# EasyEDA Pro project MINIPC_Board.eprj

# Schematic Schematic1
Create Date: 2023-06-23; Page Name: P1; Project Name: MINIPC_Board; Schematic Name: Schematic1; Update Date: 2023-08-16; Company: 嘉立创EDA; Page Size: A4; Version: V1.1
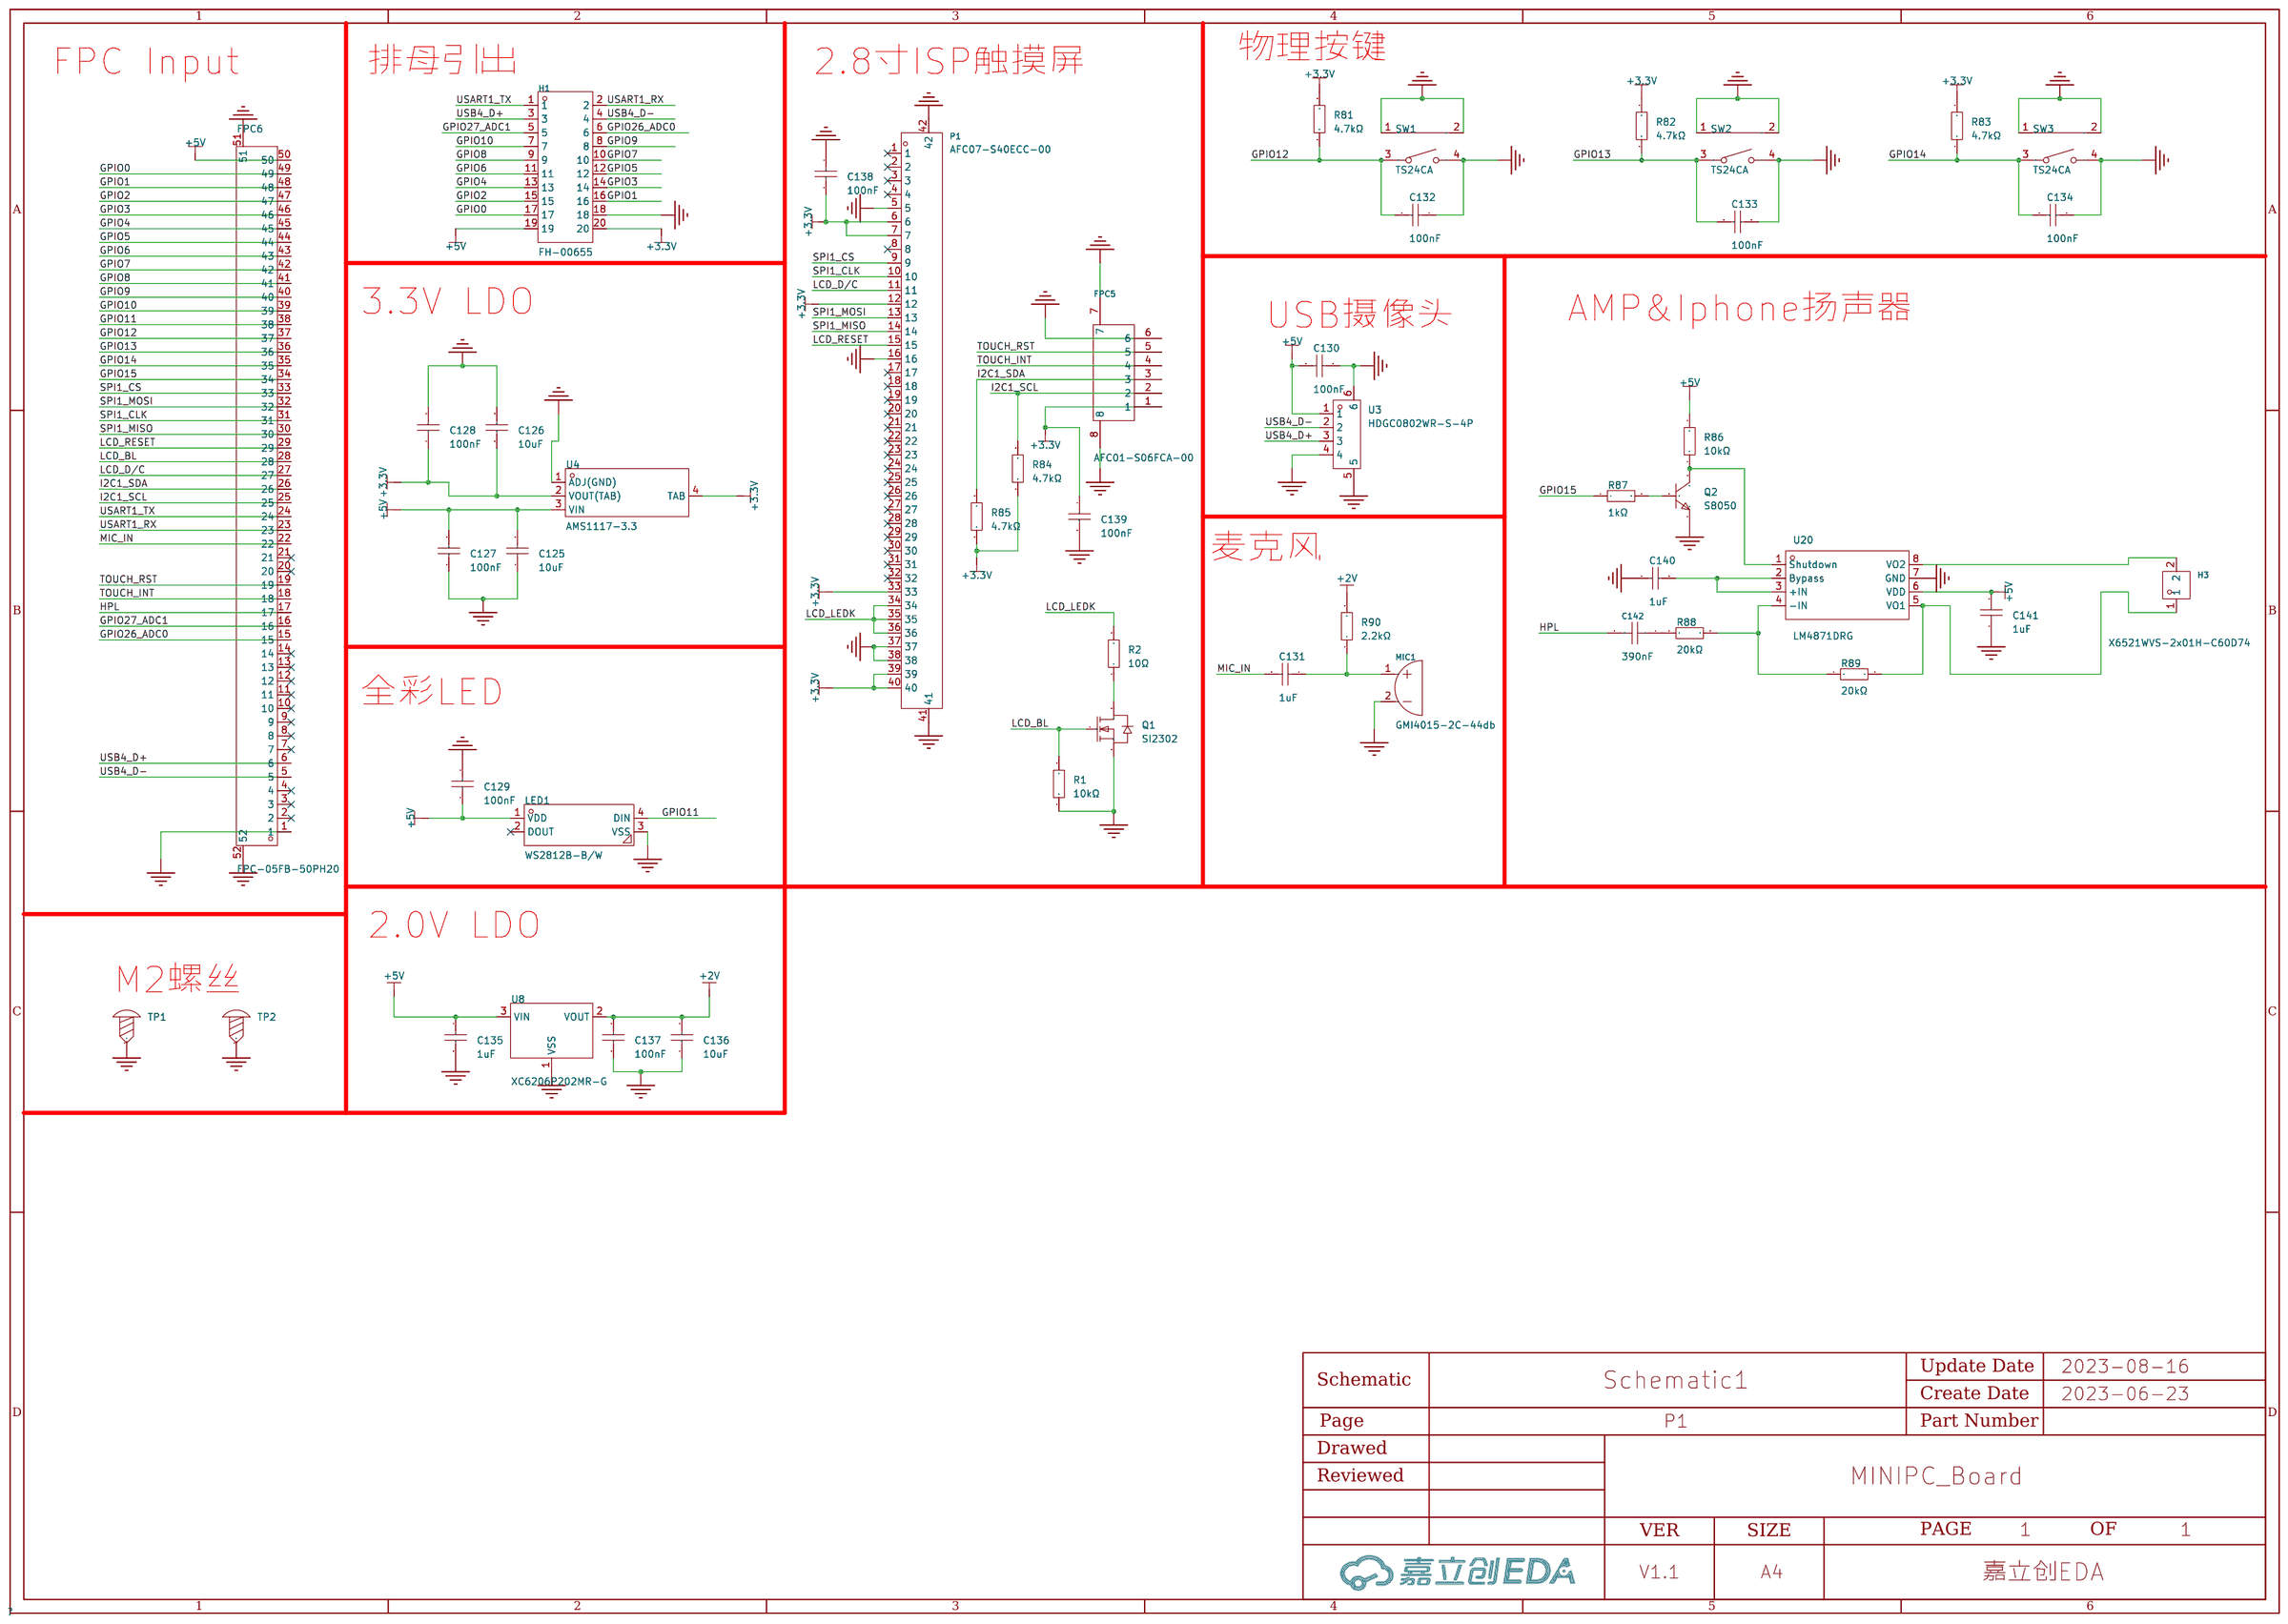
[diagram p0: schematic sheet]

## Parts
C125  10uF  [C0805]
C126  10uF  [C0805]
C127  100nF  [C0805]
C128  100nF  [C0805]
C129  100nF  [C0805]
C130  100nF  [C0805]
C131  1uF  [C0805]
C132  100nF  [C0805]
C133  100nF  [C0805]
C134  100nF  [C0805]
C135  1uF  [C0805]
C136  10uF  [C0805]
C137  100nF  [C0805]
C138  100nF  [C0805]
C139  100nF  [C0805]
C140  1uF  [C0805]
C141  1uF  [C0805]
C142  390nF  [C0805]
FPC5  AFC01-S06FCA-00  [FPC-SMD_P0.50-6P_AFC01-S06FCA-00]
FPC6  FPC-05FB-50PH20  [FPC-SMD_50P-P0.50_FPC-05FB-50PH20]
H1  FH-00655  [HDR-SMD_20P-P2.54-V-F-R2-C10-S2.54-LS7.2-1]
H3  X6521WVS-2x01H-C60D74  [HDR-SMD_2P-P2.54-V-M-R2-C1-LS7.4]
LED1  WS2812B-B/W  [LED-SMD_4P-L5.0-W5.0-BL_TC5050RGB]
MIC1  GMI4015-2C-44db  [MIC-SMD_BD4.0_GMI4015-2C-32DB]
P1  AFC07-S40ECC-00  [CONN-SMD_AFC07-S40ECC-00]
Q1  SI2302  [SOT-23-3_L2.9-W1.5-P1.90-LS2.6-BL]
Q2  S8050  [SOT-23-3_L2.9-W1.6-P1.90-LS2.8-BR]
R1  10kΩ  [R0805]
R2  10Ω  [R0805_NEW]
R81  4.7kΩ  [R0805]
R82  4.7kΩ  [R0805]
R83  4.7kΩ  [R0805]
R84  4.7kΩ  [R0805]
R85  4.7kΩ  [R0805]
R86  10kΩ  [R0805]
R87  1kΩ  [R0805]
R88  20kΩ  [R0805]
R89  20kΩ  [R0805]
R90  2.2kΩ  [R0805]
SW1  TS24CA  [SW-SMD_TS24CA]
SW2  TS24CA  [SW-SMD_TS24CA]
SW3  TS24CA  [SW-SMD_TS24CA]
TP1  -  [M2螺丝]
TP2  -  [M2螺丝]
U3  HDGC0802WR-S-4P  [CONN-SMD_4P-P0.80_HDGC_HDGC0802WR-S-4P]
U4  AMS1117-3.3  [SOT-223-4_L6.5-W3.5-P2.30-LS7.0-BR]
U8  XC6206P202MR-G  [SOT-23-3_L2.9-W1.6-P1.90-LS2.8-BR]
U20  LM4871DRG  [SOP-8_L4.9-W3.9-P1.27-LS6.0-BL]

## Library data of the parts
C125 C126 C136 = CL21A106KAYNNNE_C15850: 容值:10uF;精度:±10%;额定电压:25V;材质(温度系数):X5R;; LCSC Part Name: 10uF ±10% 25V; Supplier Part: C15850; Manufacturer: SAMSUNG(三星); Manufacturer Part: CL21A106KAYNNNE; Supplier Footprint: 0805; JLCPCB Part Class: Basic Part; Datasheet: https://atta.szlcsc.com/upload/public/pdf/source/20160103/1457707679302.pdf; Supplier: LCSC; Tolerance: ±10%; Voltage Rated: 25V; Temperature Coefficient: X5R
C127-C130 C132-C134 C137-C139 = 0805B104K500NT: 容值:100nF;精度:±10%;额定电压:50V;材质(温度系数):X7R;; LCSC Part Name: 100nF ±10% 50V; Supplier Part: C38141; Manufacturer: FH(风华); Supplier Footprint: 0805; JLCPCB Part Class: Extended Part; Datasheet: https://atta.szlcsc.com/upload/public/pdf/source/20170923/C38141_1506149447419988747.pdf; Supplier: LCSC; Tolerance: ±10%; Voltage Rated: 50V; Temperature Coefficient: X7R
C131 C135 C140 C141 = CL21B105KBFNNNE: 容值:1uF;精度:±10%;额定电压:50V;材质(温度系数):X7R;; LCSC Part Name: 1uF ±10% 50V; Supplier Part: C28323; Manufacturer: SAMSUNG(三星); Supplier Footprint: 0805; JLCPCB Part Class: Basic Part; Datasheet: https://atta.szlcsc.com/upload/public/pdf/source/20160103/1457707718219.pdf; Supplier: LCSC; Tolerance: ±10%; Voltage Rated: 50V; Temperature Coefficient: X7R
C142 = 0805B394K500CT: 容值:390nF;精度:±10%;额定电压:50V;材质(温度系数):X7R;; LCSC Part Name: 390nF ±10% 50V; Supplier Part: C384757; Manufacturer: Walsin(华新科); Supplier Footprint: 0805; JLCPCB Part Class: Extended Part; Supplier: LCSC; Tolerance: ±10%; Voltage Rated: 50V; Temperature Coefficient: X7R
FPC5 = AFC01-S06FCA-00: 间距:0.5mm;触点数量:6;锁定特性:翻盖式;安装类型:卧贴;触点类型:下接;; LCSC Part Name: FPC 0.5MM 6P 翻盖式 H2.0mm 下接; Supplier Part: C262655; Manufacturer: JS(钜硕电子); Supplier Footprint: P=0.5mm; JLCPCB Part Class: Extended Part; Supplier: LCSC; Pitch: 0.5mm; Number of Contacts: 6; Locking Feature: 翻盖式; Mounting Type: 卧贴; Contact Type: 下接; Height Above Board: 2mm; FFC, FCB Thickness: 0.3mm~0.3mm
FPC6 = FPC-05FB-50PH20: LCSC Part Name: 50P 0.5mm; Supplier Part: C2856838; Manufacturer: XUNPU(讯普); Supplier Footprint: SMD; JLCPCB Part Class: Extended Part; Datasheet: https://atta.szlcsc.com/upload/public/pdf/source/20210922/C2856838_347828C5274658FED2C30B32DE7AFA84.pdf; Supplier: LCSC
H1 = FH-00655: 排数:双排;总孔位数:20;间距:2.54mm;插孔结构:2x10P;行距:2.54mm;安装类型:立贴;圆孔/方孔:方孔;额定电流:3A;额定电压:-;插孔方向:顶部;塑高:8.5mm;工作温度范围:-40℃~+105℃;; LCSC Part Name: 2.54mm 2x10P; Supplier Part: C2829891; Manufacturer: Liansheng(连盛); Supplier Footprint: SMD,P=2.54mm; JLCPCB Part Class: Extended Part; Datasheet: 2022-08-08/481500A/efd21766f8f54edaba90848846504a55/C2829891.PDF; Supplier: LCSC; Number of Rows: 双排; Number of Holes: 20; Pitch: 2.54mm; Holes Structure: 2x10P; Row Spacing: 2.54mm; Mounting Type: 立贴; Circular Hole / Square Hole: 方孔; Current Rating (Max): 3A; Holes Direction: 顶部; Insulation Height: 8.5mm; Operating Temperature Range: -40℃~+105℃
H3 = X6521WVS-2x01H-C60D74: 间距:2.54mm;总PIN位数:2;排数:2;插针结构:2x1P;行距:-;安装类型:立贴;圆针/方针:方针;额定电流:3A;额定电压:250V;配合针长度:6mm;塑高:2.5mm;端接针长度:-;触头材质:黄铜;触头镀层:金;工作温度范围:-40℃~+105℃;焊接温度(最大值):260℃;; LCSC Part Name: 2.54mm 2x1P; Supplier Part: C2884014; Manufacturer: XKB Connectivity(中国星坤); Supplier Footprint: SMD,P=2.54mm; JLCPCB Part Class: Extended Part; Supplier: LCSC; Pitch: 2.54mm; Number of Pins: 2; Number of Rows: 2; Pin Structure: 2x1P; Mounting Type: 立贴; Circluar Pins/Square Pins: 方针; Current Rating (Max): 3A; Voltage Rating (Max): 250V; Length of Mating Pin: 6mm; Insulation Height: 2.5mm; Contact Material: 黄铜; Contact Plating: 金; Operating Temperature Range: -40℃~+105℃; Welding Temperature (Max): 260℃
LED1 = WS2812B-B/W: 发光颜色:RGB三色;; LCSC Part Name: RGB三色 （注意防潮，请查阅规格书中对应具体内容）; Supplier Part: C114586; Manufacturer: worldsemi; Supplier Footprint: SMD5050; JLCPCB Part Class: Extended Part; Datasheet: https://atta.szlcsc.com/upload/public/pdf/source/20200615/C114586_26EB6813EC9F2A3F6C7FBB2AD75DE01F.pdf; Supplier: LCSC; Emitted Color: RGB三色
MIC1 = GMI4015-2C-44db: LCSC Part Name: 全指向双电容φ4.0*1.5mm 1.5V-10V 灵敏度-44dB 低阻抗; Supplier Part: C233274; Manufacturer: INGHAi(赢海); JLCPCB Part Class: Extended Part; Datasheet: https://atta.szlcsc.com/upload/public/pdf/source/20180613/C233285_B82B48E7113DD15BB0DB65002027213C.pdf; Supplier: LCSC
P1 = AFC07-S40ECC-00: 间距:0.5mm;触点数量:40P;锁定特性:抽屉式;安装类型:卧贴;触点类型:上接;; LCSC Part Name: 0.5mm P数:40P 抽屉式 上接; Supplier Part: C11097; Manufacturer: JS(钜硕电子); Supplier Footprint: SMD,P=0.5mm; JLCPCB Part Class: Extended Part; Datasheet: https://atta.szlcsc.com/upload/public/pdf/source/20130129/1457706582878.pdf; Supplier: LCSC; Pitch: 0.5mm; Number of Contacts: 40P; Locking Feature: 抽屉式; Mounting Type: 卧贴; Contact Type: 上接; Height Above Board: 2mm; FFC, FCB Thickness: 0.3mm
Q1 = SI2302_C727152: 类型:-;漏源电压(Vdss):-;连续漏极电流(Id):-;功率(Pd):-;导通电阻(RDS(on)@Vgs,Id):-;阈值电压(Vgs(th)@Id):-;栅极电荷(Qg@Vgs):-;输入电容(Ciss@Vds):-;反向传输电容(Crss@Vds):-;; Supplier Part: C727152; Manufacturer: TWGMC(台湾迪嘉); Supplier Footprint: SOT23; JLCPCB Part Class: Extended Part; Datasheet: https://atta.szlcsc.com/upload/public/pdf/source/20200827/C727152_1F321F6C2DB40DF428E6514017B928E2.pdf; Supplier: LCSC
Q2 = S8050_C105433: 晶体管类型:NPN;集射极击穿电压(Vceo):25V;集电极电流(Ic):500mA;功率(Pd):300mW;直流电流增益(hFE@Ic,Vce):120@50mA,1V;; LCSC Part Name: NPN 25V 500mA L档 120-200; Supplier Part: C105433; Manufacturer: CJ(江苏长电/长晶); Supplier Footprint: SOT-23; JLCPCB Part Class: Extended Part; Datasheet: https://atta.szlcsc.com/upload/public/pdf/source/20170415/1492237762328.pdf; Supplier: LCSC; Transistor Type: NPN; Collector-Emitter Breakdown Voltage (Vceo): 25V; Collector Current (Ic): 500mA; Power Dissipation (Pd): 300mW; Collector Cut-Off Current (Icbo): 100nA; Collector-Emitter Saturation Voltage (VCE(sat)@Ic,Ib): 600mV@500mA,50mA; DC Current Gain (hFE@Ic,Vce): 120@50mA,1V; Transition Frequency (fT): 150MHz; Operating Temperature: +150℃@(Tj)
R1 R86 = 0805W8F1002T5E_C17414: 电阻类型:厚膜电阻;阻值:10kΩ;精度:±1%;功率:125mW;; LCSC Part Name: 10kΩ ±1% 125mW; Supplier Part: C17414; Manufacturer: UNI-ROYAL(厚声); Manufacturer Part: 0805W8F1002T5E; Supplier Footprint: 0805; JLCPCB Part Class: Basic Part; Datasheet: https://atta.szlcsc.com/upload/public/pdf/source/20200306/C422600_1E6D84923E4A46A82E41ADD87F860B5C.pdf; Supplier: LCSC; Type: 厚膜电阻; Tolerance: ±1%; Power(Watts): 125mW; Temperature Coefficient: ±100ppm/℃; Overload Voltage (Max): 150V; Operating Temperature Range: -55℃~+155℃
R2 = 0805W8F100JT5E: 电阻类型:厚膜电阻;阻值:10Ω;精度:±1%;功率:125mW;; LCSC Part Name: 10Ω ±1% 125mW; Supplier Part: C17415; Manufacturer: UNI-ROYAL(厚声); Supplier Footprint: 0805; JLCPCB Part Class: Basic Part; Datasheet: https://atta.szlcsc.com/upload/public/pdf/source/20200306/C422600_1E6D84923E4A46A82E41ADD87F860B5C.pdf; Supplier: LCSC; Type: 厚膜电阻; Tolerance: ±1%; Power(Watts): 125mW; Temperature Coefficient: ±200ppm/℃; Overload Voltage (Max): 150V; Operating Temperature Range: -55℃~+155℃
R81-R85 = 0805W8F4701T5E: 电阻类型:厚膜电阻;阻值:4.7kΩ;精度:±1%;功率:125mW;; LCSC Part Name: 4.7kΩ ±1% 125mW; Supplier Part: C17673; Manufacturer: UNI-ROYAL(厚声); Supplier Footprint: 0805; JLCPCB Part Class: Basic Part; Datasheet: https://atta.szlcsc.com/upload/public/pdf/source/20200306/C422600_1E6D84923E4A46A82E41ADD87F860B5C.pdf; Supplier: LCSC; Type: 厚膜电阻; Tolerance: ±1%; Power(Watts): 125mW; Temperature Coefficient: ±100ppm/℃; Overload Voltage (Max): 150V; Operating Temperature Range: -55℃~+155℃
R87 = 0805W8F1001T5E: 电阻类型:厚膜电阻;阻值:1kΩ;精度:±1%;功率:125mW;; LCSC Part Name: 1kΩ ±1% 125mW; Supplier Part: C17513; Manufacturer: UNI-ROYAL(厚声); Supplier Footprint: 0805; JLCPCB Part Class: Basic Part; Datasheet: https://atta.szlcsc.com/upload/public/pdf/source/20200306/C422600_1E6D84923E4A46A82E41ADD87F860B5C.pdf; Supplier: LCSC; Type: 厚膜电阻; Tolerance: ±1%; Power(Watts): 125mW; Temperature Coefficient: ±100ppm/℃; Overload Voltage (Max): 150V; Operating Temperature Range: -55℃~+155℃
R88 R89 = 0805W8F2002T5E: 电阻类型:厚膜电阻;阻值:20kΩ;精度:±1%;功率:125mW;; LCSC Part Name: 20kΩ ±1% 125mW; Supplier Part: C4328; Manufacturer: UNI-ROYAL(厚声); Supplier Footprint: 0805; JLCPCB Part Class: Basic Part; Datasheet: https://atta.szlcsc.com/upload/public/pdf/source/20200306/C422600_1E6D84923E4A46A82E41ADD87F860B5C.pdf; Supplier: LCSC; Type: 厚膜电阻; Tolerance: ±1%; Power(Watts): 125mW; Temperature Coefficient: ±100ppm/℃; Overload Voltage (Max): 150V; Operating Temperature Range: -55℃~+155℃
R90 = 0805W8F2201T5E: 电阻类型:厚膜电阻;阻值:2.2kΩ;精度:±1%;功率:125mW;; LCSC Part Name: 2.2kΩ ±1% 125mW; Supplier Part: C17520; Manufacturer: UNI-ROYAL(厚声); Supplier Footprint: 0805; JLCPCB Part Class: Basic Part; Datasheet: https://atta.szlcsc.com/upload/public/pdf/source/20200306/C422600_1E6D84923E4A46A82E41ADD87F860B5C.pdf; Supplier: LCSC; Type: 厚膜电阻; Tolerance: ±1%; Power(Watts): 125mW; Temperature Coefficient: ±100ppm/℃; Overload Voltage (Max): 150V; Operating Temperature Range: -55℃~+155℃
SW1-SW3 = TS24CA: 触点电流:50mA;额定电压(DC):12V;电路结构:单刀单掷;安装方式:卧贴;带灯:-;机械寿命:-;; LCSC Part Name: 4.55*1.8*3.5mm 卧贴 轻触开关; Supplier Part: C393942; Manufacturer: SHOU HAN(首韩); Supplier Footprint: SMD; JLCPCB Part Class: Extended Part; Datasheet: https://atta.szlcsc.com/upload/public/pdf/source/20190521/C393942_591A9E318887EFA4274D34029981AD99.pdf; Supplier: LCSC; Contact Current: 50mA; Voltage Rating (DC): 12V; Circuit: 单刀单掷; Mounting Style: 卧贴; Actuator Style: 矩形按钮; Switch Length: 4.55mm; Switch Width: 1.8mm; Switch Height: 3.5mm
TP1 TP2 = M2螺丝: Supplier Footprint: 插件
U3 = HDGC0802WR-S-4P: 间距:0.8mm;插针结构:1x4P;排数:1;每排PIN数:4;公母:公型插针;安装方式:卧贴;工作温度范围:-25℃~+85℃;; LCSC Part Name: 0.8mm 1x4P 卧贴 0.8卧贴-4P; Supplier Part: C3008772; Manufacturer: HDGC(华德共创); Supplier Footprint: SMD,P=0.8mm; JLCPCB Part Class: Extended Part; Datasheet: https://atta.szlcsc.com/upload/public/pdf/source/20220428/C3E984054E3B11ECA1268817634A076D.pdf; Supplier: LCSC; Pitch: 0.8mm; Pins Structure: 1x4P; Number of Rows: 1; Number of PINs Per Row: 4; Gender: 公型插针; Mounting Style: 卧贴; Operating Temperature Range: -25℃~+85℃
U4 = AMS1117-3.3_C347222: 输出类型:固定;输出极性:正;最大输入电压:18V;输出电压:3.3V;输出电流:1A;电源纹波抑制比(PSRR):60dB@(120Hz);; Supplier Part: C347222; Manufacturer: UMW(广东友台半导体); Supplier Footprint: SOT-223; JLCPCB Part Class: Extended Part; Datasheet: https://atta.szlcsc.com/upload/public/pdf/source/20211011/50CC665C22E3A66C08379A4A74BDA25C.pdf; Supplier: LCSC; Output Type: 固定; Output Polarity: 正; Number of Outputs: 1; Maximum Input Voltage: 18V; Output Voltage: 3.3V; Dropout Voltage: 1.3V@(1A); Output Current: 1A; Power Supply Rejection Ratio (PSRR): 60dB@(120Hz)
U8 = XC6206P202MR-G: 输出类型:固定;输出极性:正;最大输入电压:8V;输出电压:3V;输出电流:300mA;; Supplier Part: C2891260; Manufacturer: TOREX(特瑞仕); Supplier Footprint: SOT-23-3L; JLCPCB Part Class: Extended Part; Datasheet: https://atta.szlcsc.com/upload/public/pdf/source/20200117/C484266_EE638359EA530088949E891FD0EEEA32.pdf; Supplier: LCSC; Output Type: 固定; Output Polarity: 正; Number of Outputs: 1; Maximum Input Voltage: 8V; Output Voltage: 3V; Dropout Voltage: 240mV@(50mA); Output Current: 300mA
U20 = LM4871DRG: LCSC Part Name: 3W 单声道 AB 类音频功率放大器; Supplier Part: C2977084; Manufacturer: HGC(深圳汉芯); Supplier Footprint: SOP-8; JLCPCB Part Class: Extended Part; Datasheet: https://atta.szlcsc.com/upload/public/pdf/source/20220308/B7DC1C3731235201084084BFF2780ABF.pdf; Supplier: LCSC

## Nets
+2V: C136.2 C137.2 R90.2 U8.2(VOUT)
+3.3V: C126.1 C128.1 C138.2 C139.1 FPC5.1 H1.20 P1.6 P1.7 P1.12 P1.33 P1.39 P1.40 R81.2 R82.2 R83.2 R84.1 R85.1 U4.2(VOUT(TAB)) U4.4(TAB)
+5V: C125.2 C127.2 C129.1 C130.2 C135.1 C141.2 FPC6.50 H1.19 LED1.1(VDD) R86.2 U3.1 U4.3(VIN) U8.3(VIN) U20.6(VDD)
GND: C125.1 C126.2 C127.1 C128.2 C129.2 C130.1 C132.1 C133.1 C134.1 C135.2 C136.1 C137.1 C138.1 C139.2 C140.1 C141.1 FPC5.6 FPC5.7 FPC5.8 FPC6.1 FPC6.51 FPC6.52 H1.18 LED1.3(VSS) MIC1.2(-) P1.5 P1.16 P1.37 P1.38 P1.41 P1.42 Q1.2(S) Q2.2 R1.1 SW1.1 SW1.2 SW1.4 SW2.1 SW2.2 SW2.4 SW3.1 SW3.2 SW3.4 TP1.1 TP2.1 U3.4 U3.5 U3.6 U4.1(ADJ(GND)) U8.1(VSS) U20.7(GND)
GPIO0: FPC6.49 H1.17
GPIO1: FPC6.48 H1.16
GPIO2: FPC6.47 H1.15
GPIO3: FPC6.46 H1.14
GPIO4: FPC6.45 H1.13
GPIO5: FPC6.44 H1.12
GPIO6: FPC6.43 H1.11
GPIO7: FPC6.42 H1.10
GPIO8: FPC6.41 H1.9
GPIO9: FPC6.40 H1.8
GPIO10: FPC6.39 H1.7
GPIO11: FPC6.38 LED1.4(DIN)
GPIO12: C132.2 FPC6.37 R81.1 SW1.3
GPIO13: C133.2 FPC6.36 R82.1 SW2.3
GPIO14: C134.2 FPC6.35 R83.1 SW3.3
GPIO15: FPC6.34 R87.1
GPIO26_ADC0: FPC6.15 H1.6
GPIO27_ADC1: FPC6.16 H1.5
HPL: C142.2 FPC6.17
I2C1_SCL: FPC5.2 FPC6.25 R84.2
I2C1_SDA: FPC5.3 FPC6.26 R85.2
LCD_BL: FPC6.28 Q1.1(G) R1.2
LCD_D/C: FPC6.27 P1.11
LCD_LEDK: P1.34 P1.35 P1.36 R2.2
LCD_RESET: FPC6.29 P1.15
MIC_IN: C131.2 FPC6.22
SPI1_CLK: FPC6.31 P1.10
SPI1_CS: FPC6.33 P1.9
SPI1_MISO: FPC6.30 P1.14
SPI1_MOSI: FPC6.32 P1.13
TOUCH_INT: FPC5.4 FPC6.18
TOUCH_RST: FPC5.5 FPC6.19
USART1_RX: FPC6.23 H1.2
USART1_TX: FPC6.24 H1.1
USB4_D+: FPC6.6 H1.3 U3.3
USB4_D-: FPC6.5 H1.4 U3.2
$1N5124: Q2.1 R87.2
$1N5125: Q2.3 R86.1 U20.1(Shutdown)
$1N5129: C140.2 U20.2(Bypass) U20.3(+IN)
$1N5132: R88.2 R89.1 U20.4(-IN)
$1N7696: C131.1 MIC1.1(+) R90.1
$1N12468: Q1.3(D) R2.1
$1N17864: C142.1 R88.1
$1N17956: H3.2 U20.8(VO2)
$1N17960: H3.1 R89.2 U20.5(VO1)

Not connected (* = marked no-connect by the designer): FPC6 2* 3* 4* 7* 8* 9* 10* 11* 12* 13* 14* 20* 21*; LED1 2(DOUT)*; P1 1* 2* 3* 4* 8* 17* 18* 19* 20* 21* 22* 23* 24* 25* 26* 27* 28* 29* 30* 31* 32*

## Notes on the sheet
- 物理按键
- FPC Input
- 排母引出
- 2.8寸ISP触摸屏
- 3.3V LDO
- AMP&Iphone扬声器
- USB摄像头
- 麦克风
- 全彩LED
- 2.0V LDO
- M2螺丝

# Board PCB1
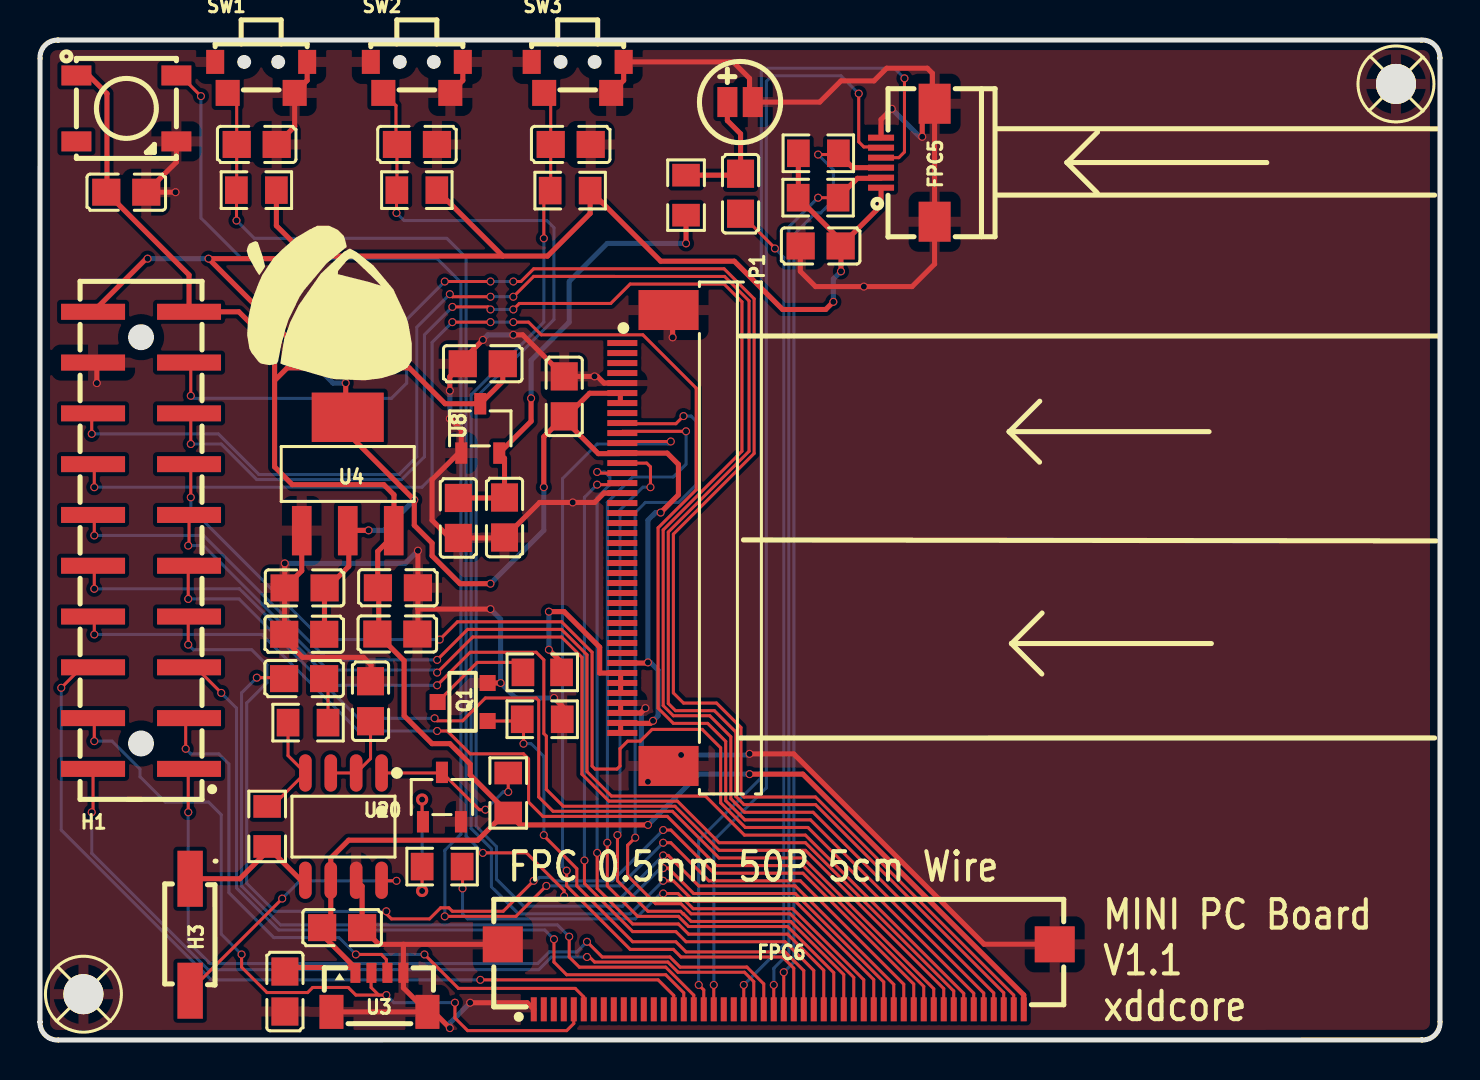
[diagram p1: board, top side]
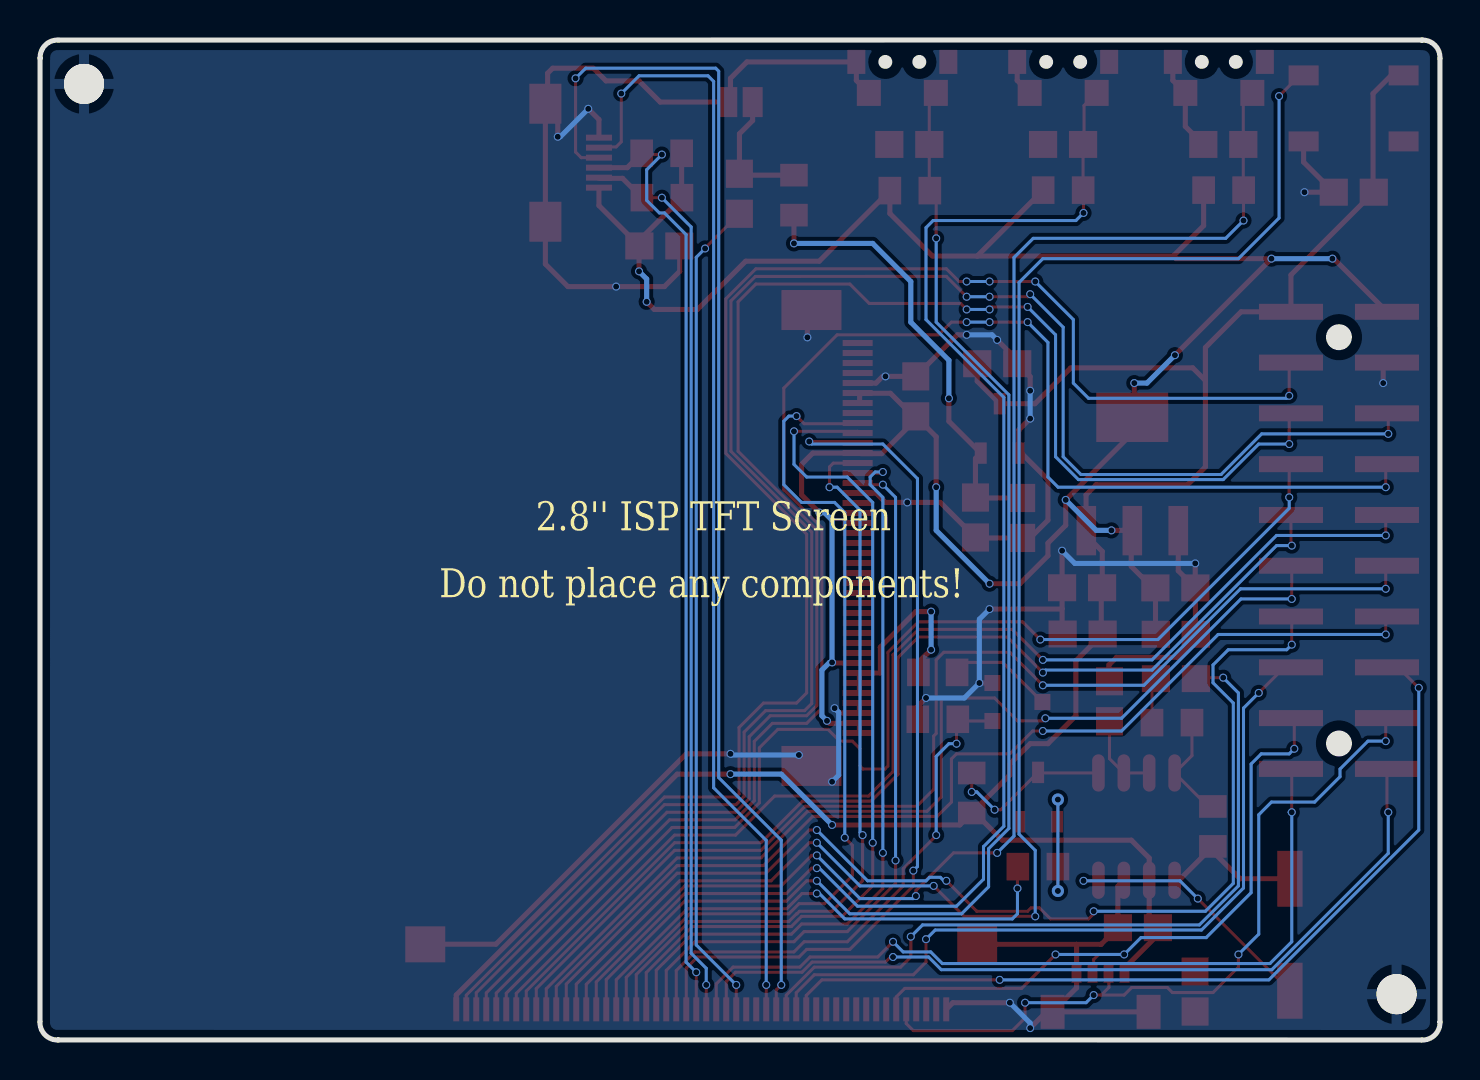
[diagram p2: board, bottom side, seen from below]

Outline 70.01 x 50.01 mm; copper layers: Top Layer, Bottom Layer. Coordinates in mm from the lower left corner of the outline.
Outline path: 0,0.9 0,0.9 0,49.09 arc(0.25,49.75) 0.91,50.01 0.89,50.01 ; 0,0.91 arc(0.26,0.25) 0.92,0 69.1,0.01 ; 0.89,50.01 69.08,50.01 arc(69.74,49.76) 70,49.1 70,49.1 70.01,0.92 arc(69.76,0.26) 69.1,0 69.1,0
Stack: Top Layer 0.035mm / Dielectric1 1.51mm FR4 er 4.5 / Bottom Layer 0.035mm

## Design rules (mm)
template: 自定义配置
spacing copperThickness1oz (default): track to track 0.102, other pairs 0.152 to 0.3
spacing copperThickness2oz: track to track 0.203, other pairs 0.152 to 0.3
track width copperThickness1oz (default): min 0.127, default 0.254, max 2.54
track width copperThickness2oz: min 0.203, default 0.254, max 2.54
differential pair differentialPair (default): width min 0.127, default 0.254, max 2.54; gap min 0.152, default 0.152
via viaSize (default): diameter min 0.4, default 0.4, max 10; hole min 0.3, default 0.3, max 6.3

## Placement (name value [footprint] x y rotation side)
C125  10uF  [C0805]  17.9 22.62 180 top
C126  10uF  [C0805]  13.23 22.61 180 top
C127  100nF  [C0805]  17.87 20.3 180 top
C128  100nF  [C0805]  13.21 20.29 180 top
C129  100nF  [C0805]  4.31 42.4 0 top
C130  100nF  [C0805]  12.25 2.42 90 top
C131  1uF  [C0805]  35.03 42.32 270 top
C132  100nF  [C0805]  10.84 44.79 180 top
C133  100nF  [C0805]  18.85 44.79 180 top
C134  100nF  [C0805]  26.54 44.79 180 top
C135  1uF  [C0805]  22.14 33.82 180 top
C136  10uF  [C0805]  20.92 26.11 90 top
C137  100nF  [C0805]  23.23 26.13 90 top
C138  100nF  [C0805]  26.21 32.19 270 top
C139  100nF  [C0805]  39.04 39.71 180 top
C140  1uF  [C0805]  16.53 16.94 270 top
C141  1uF  [C0805]  15.11 5.62 180 top
C142  390nF  [C0805]  13.21 18.07 180 top
FPC5  AFC01-S06FCA-00  [FPC-SMD_P0.50-6P_AFC01-S06FCA-00]  43.4 43.87 90 top
FPC6  FPC-05FB-50PH20  [FPC-SMD_50P-P0.50_FPC-05FB-50PH20]  36.94 3.16 180 top
H1  FH-00655  [HDR-SMD_20P-P2.54-V-F-R2-C10-S2.54-LS7.2-1]  5.05 24.99 90 top
H3  X6521WVS-2x01H-C60D74  [HDR-SMD_2P-P2.54-V-M-R2-C1-LS7.4]  7.51 5.26 180 top
LED1  WS2812B-B/W  [LED-SMD_4P-L5.0-W5.0-BL_TC5050RGB]  4.32 46.59 0 top
MIC1  GMI4015-2C-44db  [MIC-SMD_BD4.0_GMI4015-2C-32DB]  35.01 46.91 0 top
P1  AFC07-S40ECC-00  [CONN-SMD_AFC07-S40ECC-00]  30.27 25.11 270 top
Q1  SI2302  [SOT-23-3_L2.9-W1.5-P1.90-LS2.6-BL]  21.13 16.9 90 top
Q2  S8050  [SOT-23-3_L2.9-W1.6-P1.90-LS2.8-BR]  20.1 12.15 270 top
R1  10kΩ  [R0805]  25.11 16.04 180 top
R2  10Ω  [R0805_NEW]  25.12 18.39 0 top
R81  4.7kΩ  [R0805]  10.82 42.5 0 top
R82  4.7kΩ  [R0805]  18.84 42.5 0 top
R83  4.7kΩ  [R0805]  26.51 42.48 0 top
R84  4.7kΩ  [R0805]  38.91 42.13 0 top
R85  4.7kΩ  [R0805]  38.92 44.35 0 top
R86  10kΩ  [R0805]  23.41 12.35 270 top
R87  1kΩ  [R0805]  20.11 8.67 180 top
R88  20kΩ  [R0805]  13.4 15.87 180 top
R89  20kΩ  [R0805]  11.36 10.68 270 top
R90  2.2kΩ  [R0805]  32.31 42.25 270 top
SW1  TS24CA  [SW-SMD_TS24CA]  11.06 48.14 0 top
SW2  TS24CA  [SW-SMD_TS24CA]  18.84 48.14 0 top
SW3  TS24CA  [SW-SMD_TS24CA]  26.89 48.14 0 top
TP1  -  [M2螺丝]  67.81 47.81 0 top
TP2  -  [M2螺丝]  2.17 2.29 0 top
U3  HDGC0802WR-S-4P  [CONN-SMD_4P-P0.80_HDGC_HDGC0802WR-S-4P]  16.97 2.38 0 top
U4  AMS1117-3.3  [SOT-223-4_L6.5-W3.5-P2.30-LS7.0-BR]  15.39 28.31 270 top
U8  XC6206P202MR-G  [SOT-23-3_L2.9-W1.6-P1.90-LS2.8-BR]  22.02 30.59 270 top
U20  LM4871DRG  [SOP-8_L4.9-W3.9-P1.27-LS6.0-BL]  15.17 10.67 180 top

## Footprints (pads in the part's own frame, mm; a bottom-side part is the same pattern mirrored in y, then rotated)
C0805
  rect 1.41x1.35 smd: 1(-1,0) 2(1,0)
CONN-SMD_4P-P0.80_HDGC_HDGC0802WR-S-4P
  rect 0.5x1 smd: 1(-1.2,0.975) 2(-0.4,0.975) 3(0.4,0.975) 4(1.2,0.975)
  rect 1.2x1.7 smd: 5(2.4,-0.975) 6(-2.4,-0.975)
CONN-SMD_AFC07-S40ECC-00
  rect 0.3x1.5 smd: 1(-9.75,-1.153) 2(-9.249,-1.153) 3(-8.749,-1.153) 4(-8.249,-1.153) 5(-7.75,-1.153) 6(-7.249,-1.153) 7(-6.749,-1.153) 8(-6.249,-1.153) 9(-5.749,-1.153) 10(-5.248,-1.153) 11(-4.748,-1.153) 12(-4.248,-1.153) 13(-3.748,-1.153) 14(-3.248,-1.153) 15(-2.748,-1.155) 16(-2.248,-1.154) 17(-1.748,-1.153) 18(-1.248,-1.153) 19(-0.748,-1.153) 20(-0.248,-1.157) 21(0.252,-1.157) 22(0.751,-1.157) 23(1.252,-1.157) 24(1.752,-1.157) 25(2.252,-1.157) 26(2.752,-1.157) 27(3.252,-1.157) 28(3.752,-1.157) 29(4.252,-1.157) 30(4.751,-1.157) 31(5.251,-1.157) 32(5.751,-1.157) 33(6.25,-1.157) 34(6.751,-1.157) 35(7.25,-1.157) 36(7.75,-1.153) 37(8.251,-1.153) 38(8.75,-1.153) 39(9.25,-1.153) 40(9.75,-1.153)
  rect 2x3 smd: 41(11.4,1.157) 42(-11.4,1.157)
FPC-SMD_50P-P0.50_FPC-05FB-50PH20
  rect 0.3x1.2 smd: 1(12.25,1.625) 2(11.75,1.625) 3(11.25,1.625) 4(10.75,1.625) 5(10.25,1.625) 6(9.75,1.625) 7(9.25,1.625) 8(8.75,1.625) 9(8.25,1.625) 10(7.75,1.625) 11(7.25,1.625) 12(6.75,1.625) 13(6.25,1.625) 14(5.75,1.625) 15(5.25,1.625) 16(4.75,1.625) 17(4.25,1.625) 18(3.75,1.625) 19(3.25,1.625) 20(2.75,1.625) 21(2.25,1.625) 22(1.75,1.625) 23(1.25,1.625) 24(0.75,1.625) 25(0.25,1.625) 26(-0.25,1.625) 27(-0.75,1.625) 28(-1.25,1.625) 29(-1.75,1.625) 30(-2.25,1.625) 31(-2.75,1.625) 32(-3.25,1.625) 33(-3.75,1.625) 34(-4.25,1.625) 35(-4.75,1.625) 36(-5.25,1.625) 37(-5.75,1.625) 38(-6.25,1.625) 39(-6.75,1.625) 40(-7.25,1.625) 41(-7.75,1.625) 42(-8.25,1.625) 43(-8.75,1.625) 44(-9.25,1.625) 45(-9.75,1.625) 46(-10.25,1.625) 47(-10.75,1.625) 48(-11.25,1.625) 49(-11.75,1.625) 50(-12.25,1.625)
  rect 2x1.8 smd: 51(-13.8,-1.625) 52(13.8,-1.625)
FPC-SMD_P0.50-6P_AFC01-S06FCA-00
  rect 0.3x1.3 smd: 1(-1.248,1.339) 2(-0.748,1.339) 3(-0.248,1.339) 4(0.252,1.339) 5(0.752,1.339) 6(1.252,1.339)
  rect 2x1.6 smd: 7(-2.95,-1.339) 8(2.95,-1.339)
HDR-SMD_2P-P2.54-V-M-R2-C1-LS7.4
  rect 1.27x2.8 smd: 1(0,-2.8) 2(0,2.8)
HDR-SMD_20P-P2.54-V-F-R2-C10-S2.54-LS7.2-1
  rect 0.8x3.2 smd: 1(-11.43,-2.4) 2(-11.43,2.4) 3(-8.89,-2.4) 4(-8.89,2.4) 5(-6.35,-2.4) 6(-6.35,2.4) 7(-3.81,-2.4) 8(-3.81,2.4) 9(-1.27,-2.4) 10(-1.27,2.4) 11(1.27,-2.4) 12(1.27,2.4) 13(3.81,-2.4) 14(3.81,2.4) 15(6.35,-2.4) 16(6.35,2.4) 17(8.89,-2.4) 18(8.89,2.4) 19(11.43,-2.4) 20(11.43,2.4)
LED-SMD_4P-L5.0-W5.0-BL_TC5050RGB
  rect 1.5x1 smd: 1(-2.5,1.65) 2(-2.5,-1.65) 3(2.5,-1.65) 4(2.5,1.65)
M2螺丝
  round 2 hole 2: 1(0,0)
MIC-SMD_BD4.0_GMI4015-2C-32DB
  rect 1x1.5 smd: 1(-0.635,0) 2(0.635,0)
R0805
  rect 1.133x1.377 smd: 1(-1,0) 2(1,0)
R0805_NEW
  rect 1.133x1.377 smd: 1(-0.966,0) 2(0.966,0)
SOP-8_L4.9-W3.9-P1.27-LS6.0-BL
  oval 0.63x1.865 smd: 1(-1.905,-2.683) 2(-0.635,-2.683) 3(0.635,-2.683) 4(1.905,-2.683) 5(1.905,2.683) 6(0.635,2.683) 7(-0.635,2.683) 8(-1.905,2.683)
SOT-23-3_L2.9-W1.5-P1.90-LS2.6-BL
  rect 0.8x0.8 smd: 1(-0.95,-1.25) 2(0.95,-1.25) 3(0,1.25)
SOT-23-3_L2.9-W1.6-P1.90-LS2.8-BR
  rect 1.07x0.6 smd: 1(1.235,-0.95) 2(1.235,0.95) 3(-1.235,0)
SOT-223-4_L6.5-W3.5-P2.30-LS7.0-BR
  rect 2.47x0.98 smd: 1(2.835,-2.3) 2(2.835,0) 3(2.835,2.3)
  rect 2.47x3.6 smd: 4(-2.835,0)
SW-SMD_TS24CA
  rect 0.9x1.2 smd: 1(-2.3,0.775) 2(2.3,0.775)
  rect 1.2x1.3 smd: 3(-1.675,-0.775) 4(1.675,-0.775)

## Nets
As in the schematic.

Pads without a net: FPC6 2 3 4 7 8 9 10 11 12 13 14 20 21; LED1 2; P1 1 2 3 4 8 17 18 19 20 21 22 23 24 25 26 27 28 29 30 31 32

## Via types
v1: diameter 0.4, hole 0.3, Top Layer to Bottom Layer, 133 vias
v2: diameter 0.61, hole 0.305, Top Layer to Bottom Layer, 2 vias

## Routing (per net, layer and track width the routed paths; a pad name or vN(x,y) marks a point on that pad's centre or on a via; arc(x,y) is an arc through that point)
+2V: length 22.7
  Top Layer w0.254: C136.2 23.21,27.11 C137.2 23.23,29.09 U8.2 24.56,30.94 v1(24.56,32.09) ; v1(32.31,39.84) R90.2
  Bottom Layer w0.254: v1(24.56,32.09) 24.56,34 26.46,35.9 26.46,37.93 28.37,39.84 v1(32.31,39.84)
+3.3V: length 133.5
  Top Layer w0.254: 29.03,15.35 29.03,15.85 29.05,15.84 30.53,15.84 v1(30.65,15.96) ; v1(13.25,34.25) v1(8.43,39.08) 13.21,39.08 13.34,39.21 ; R82.2 23.14,39.21 ; 23.14,39.21 13.34,39.21 ; 23.14,39.21 25.38,39.21 27.51,41.34 R83.2 31.04,38.95 34.72,38.95 37.13,36.54 39.29,36.54 v1(39.67,36.92) ; 40.16,39.84 42.06,41.73 FPC5.1 ; 40.16,39.84 C139.1 40.05,39.7 v1(40.05,38.44) ; 40.16,39.84 40.16,39.87 R84.1 37.92,42.14 R85.1 ; 13.34,39.21 11.82,40.72 R81.2 ; v1(22.53,22.82) 21,22.82 19.6,24.22 19.6,24.85 18.72,25.74 v1(18.72,27.01) 15.39,30.34 U4.4 15.29,31.24 v1(15.29,32.85) ; 26.3,31.17 27.48,32.34 29.04,32.34 ; 14.2,22.6 14.23,22.58 14.23,20.23 ; v1(25.19,27.65) 25.19,30.17 C138.2 ; 29.02,31.86 29.02,32.28 28.97,32.32 ; 29.03,18.85 30.37,18.85 v1(30.4,18.88) ; 28.97,29.32 27.92,29.32 26.44,30.81 ; H1.20 5.31,39.08 v1(5.38,39.08) ; 15.44,24.85 15.44,23.69 14.28,22.53 ; v1(16.43,25.49) 15.4,25.49 U4.2 ; 29.03,29.35 31.36,29.35 31.92,28.79 31.92,27.27 v1(31.03,26.38)
  Bottom Layer w0.254: v1(13.25,34.25) 14.65,32.85 v1(15.29,32.85) ; v1(18.72,27.01) 17.19,25.49 v1(16.43,25.49) ; v1(25.19,27.65) 25.19,25.49 v1(22.53,22.82) ; v1(39.67,36.92) 39.67,38.06 v1(40.05,38.44) ; v1(31.03,26.38) 30.78,26.38 30.4,26 v1(30.4,18.88) 30.53,18.88 30.91,18.5 30.91,16.22 v1(30.65,15.96) ; v1(5.38,39.08) v1(8.43,39.08)
+5V: length 117.7
  Top Layer w0.254: 23.5,11.26 24.01,10.76 v1(30.4,10.76) ; 23.5,11.26 23.16,11.26 21.89,9.99 15.43,9.99 14.54,9.1 U20.6 14.54,5.96 ; 23.5,11.26 R86.2 21.51,13.26 21.51,13.8 20.49,14.82 19.6,14.82 18.21,16.22 18.21,18.97 16.88,20.29 ; C135.1 23.14,32.95 U8.3 20.26,31.82 18.46,33.62 12.37,33.62 11.73,32.98 ; 15.74,3.63 14.17,5.2 14.17,5.53 ; 15.74,3.63 15.78,3.63 ; 15.74,3.63 12.26,3.63 ; 15.74,3.63 15.78,3.58 ; 16.88,20.29 16.84,20.25 ; 16.88,20.29 C127.2 ; 16.88,20.29 16.94,20.36 16.94,22.53 ; v1(35.48,13.3) 38.15,13.3 49.19,2.25 FPC6.50 ; LED1.1 2.44,48.24 3.35,47.33 3.35,42.43 C129.1 7.45,38.26 H1.19 9.94,36.42 11.73,34.63 11.73,32.98 ; 11.73,32.98 11.73,28.66 12.62,27.77 17.19,27.77 17.7,27.27 17.7,25.48 17.82,25.37 16.89,24.44 16.89,22.58 ; 14.03,5.46 14.53,5.96
  Bottom Layer w0.254: v1(35.48,13.3) 32.94,13.3 v1(30.4,10.76)
GND: length 177.5
  Top Layer w0.254: LED1.3 6.82,43.91 C129.2 v1(6.78,42.4) ; FPC5.8 FPC5.7 44.73,38.81 43.61,37.68 v1(41.2,37.68) 38.78,37.68 38.02,38.44 38.02,39.7 C139.2 ; FPC5.8 44.12,46.2 v1(44.12,45.17) ; FPC5.8 44.62,46.94 44.62,48.35 44.37,48.6 42.34,48.6 41.7,47.97 40.05,47.97 38.99,46.91 MIC1.2 35.48,47.07 35.48,48.09 34.66,48.92 SW3.2 29.19,47.99 SW3.4 ; C140.1 16.56,17.97 16.56,18.76 16.18,19.14 13.13,19.14 12.21,20.05 C128.2 12.23,20.31 C126.2 12.24,22.62 ; 29.03,27.35 28.2,27.35 27.73,26.88 v1(26.64,26.88) 24.98,26.88 C137.1 23.21,25.11 C136.1 20.49,25.11 19.6,26 19.6,28.02 21.07,29.49 21.07,30.5 v1(20.49,31.08) ; U3.6 U3.5 ; U3.5 18.17,2.61 U3.4 ; U3.5 19.68,1.41 v1(20.49,0.6) ; v1(20.49,32.47) 20.49,33.17 C135.2 21.14,34.01 v1(22.14,35.01) ; 18.17,4.78 16.94,4.78 C141.1 16.11,7.69 U20.7 ; 18.17,4.78 18.17,3.36 ; 18.17,4.78 FPC6.52 ; 29.03,32.85 28.21,32.85 27.87,33.19 C138.1 24.14,35.27 v1(23.67,35.27) ; 18.9,21.57 C125.1 v1(18.9,24.47) ; 18.9,21.57 18.92,21.55 v1(22.53,21.55) ; 18.9,21.57 18.9,20.33 C127.1 ; 29.03,16.85 29.03,16.35 30.03,16.35 v1(30.27,16.6) ; Q1.2 v1(23.03,17.85) ; v1(25.7,17.11) 26.11,16.69 R1.1 ; 12.24,22.62 13.09,23.47 U4.1 ; 12.24,22.62 v1(12.24,23.84) ; FPC6.1 24.36,1.87 v1(21.51,1.87) ; H1.18 2.84,33.69 v1(2.84,32.85) ; 50.62,4.79 47.21,4.79 37.69,14.31 v1(35.48,14.31) ; C132.1 12.73,45.69 SW1.4 13.36,47.99 SW1.2 ; SW2.4 21.14,47.99 SW2.2 ; FPC5.6 42.06,46.03 v1(42.59,46.57) ; 31.63,36.55 v1(31.63,35.14) ; v1(30.4,12.91) 30.9,12.91 31.63,13.65
  Bottom Layer w0.254: v1(23.67,35.27) 22.4,35.27 v1(22.14,35.01) ; v1(35.48,14.31) 35.42,14.25 v1(32.06,14.25) ; v1(22.53,21.55) 23.03,21.04 v1(23.03,17.85) 23.78,17.11 v1(25.7,17.11) ; v1(44.12,45.17) 43.99,45.17 v1(42.59,46.57) ; v1(30.27,16.6) 30.07,16.39 30.07,13.24 v1(30.4,12.91) ; v1(21.51,1.87) 20.49,0.85 v1(20.49,0.6) ; v1(12.24,23.84) 18.26,23.84 v1(18.9,24.47) ; v1(20.49,31.08) v1(20.49,32.47)
  vias: v1(27.73,33.19)
GPIO0: length 82.4
  Top Layer w0.152: v1(7.54,32.22) 7.54,33.79 H1.17 ; FPC6.49 48.69,2.24 38.78,12.15 35.2,12.15 35.05,12.3 35.05,15.63 33.83,16.85 32.18,16.85 31.67,17.36 ; v1(22.53,37.93) v1(20.24,37.93) ; v1(23.67,37.93) 24.05,37.93 24.69,38.57 34.21,38.57 35.71,37.07 35.71,29.34 31.67,25.3 31.67,17.36
  Bottom Layer w0.152: v1(20.24,37.93) 18.33,36.03 18.33,32.85 17.57,32.09 7.67,32.09 v1(7.54,32.22) ; v1(23.67,37.93) v1(22.53,37.93)
GPIO1: length 90.6
  Top Layer w0.152: v1(22.53,37.17) 20.62,37.17 v1(20.49,37.3) ; v1(23.67,37.17) 24.69,38.19 34.23,38.19 35.46,36.96 35.46,29.44 31.42,25.4 31.42,16.83 31.78,16.47 33.72,16.47 34.8,15.4 34.8,12.18 35.2,11.77 38.78,11.77 48.19,2.36 FPC6.48 ; v1(2.59,30.31) 2.59,31.27 H1.16
  Bottom Layer w0.152: v1(20.49,37.3) 18.84,35.65 18.84,29.17 17.95,28.28 10.95,28.28 8.92,30.31 v1(2.59,30.31) ; v1(23.67,37.17) v1(22.53,37.17)
GPIO2: length 84.9
  Top Layer w0.152: v1(22.53,36.54) 22.4,36.66 v1(20.62,36.66) ; v1(23.67,36.54) 23.97,36.83 28.54,36.83 29.51,37.81 34.21,37.81 35.1,36.92 35.1,29.45 31.16,25.51 31.16,16.72 31.67,16.22 33.49,16.22 34.54,15.16 34.54,12.07 35.23,11.39 38.66,11.39 47.69,2.35 FPC6.47 ; v1(7.54,29.81) 7.54,31.25 H1.15
  Bottom Layer w0.152: v1(7.54,29.81) 9.06,29.81 10.84,28.03 18.08,28.03 19.22,29.17 19.22,35.27 v1(20.62,36.66) ; v1(23.67,36.54) v1(22.53,36.54)
GPIO3: length 81.5
  Top Layer w0.152: v1(23.67,35.9) 24.43,35.9 25.07,35.27 30.15,35.27 32.81,32.6 32.81,27.52 30.91,25.61 30.91,16.6 31.67,15.84 33.39,15.84 34.29,14.93 34.29,11.97 35.25,11.01 38.53,11.01 47.19,2.35 FPC6.46 ; v1(2.71,27.65) 2.71,28.74 H1.14 ; v1(22.53,35.9) v1(20.62,35.9)
  Bottom Layer w0.152: v1(2.71,27.65) 19.1,27.65 19.6,28.15 19.6,34.89 v1(20.62,35.9) ; v1(23.67,35.9) v1(22.53,35.9)
GPIO4: length 60.1
  Top Layer w0.152: v1(19.99,20.03) 20.88,20.92 26.08,20.92 27.61,19.39 27.61,13.7 27.76,13.55 28.85,13.55 29,13.7 29,14.57 29.38,14.95 30.02,14.95 30.61,15.53 33.11,15.53 34.04,14.61 34.04,11.86 35.27,10.63 38.4,10.63 46.69,2.34 FPC6.45 ; H1.13 7.54,28.71 v1(7.54,27.14)
  Bottom Layer w0.152: v1(7.54,27.14) 7.54,26.59 14.11,20.03 v1(19.99,20.03)
GPIO5: length 59.5
  Top Layer w0.152: v1(19.86,19.01) 21.38,20.53 26.08,20.53 27.35,19.26 27.35,13.42 28.57,12.2 33.27,12.2 35.23,10.25 38.27,10.25 46.19,2.33 FPC6.44 ; v1(2.71,25.23) 2.71,26.2 H1.12
  Bottom Layer w0.152: v1(2.71,25.23) 8.17,25.23 14.4,19.01 v1(19.86,19.01)
GPIO6: length 54.9
  Top Layer w0.152: v1(7.41,24.73) 7.45,24.77 H1.11 ; FPC6.43 45.69,2.45 38.27,9.87 33.96,9.87 31.88,11.95 28.45,11.95 27.1,13.3 27.1,19.14 26.08,20.15 21.64,20.15 v1(19.86,18.38)
  Bottom Layer w0.152: v1(7.41,24.73) 8.17,24.73 14.4,18.5 19.73,18.5 v1(19.86,18.38)
GPIO7: length 58.1
  Top Layer w0.152: H1.10 2.71,23.66 v1(2.71,22.57) ; v1(19.86,17.74) 21.51,19.39 24.81,19.39 25.19,19.01 25.19,15.33 25.32,15.2 25.32,12.53 26.16,11.69 31.75,11.69 33.96,9.49 38.27,9.49 45.19,2.57 FPC6.42
  Bottom Layer w0.152: v1(2.71,22.57) 9.97,22.57 14.8,17.74 v1(19.86,17.74)
GPIO8: length 51.8
  Top Layer w0.152: v1(19.73,16.09) 19.86,15.96 21.13,15.96 22.27,17.11 24.81,17.11 24.94,16.98 24.94,12.15 25.65,11.44 31.62,11.44 33.96,9.1 38.15,9.1 44.69,2.56 FPC6.41 ; H1.9 7.41,23.68 v1(7.41,22.06)
  Bottom Layer w0.152: v1(7.41,22.06) 9.95,22.06 15.92,16.09 v1(19.73,16.09)
GPIO9: length 52.1
  Top Layer w0.152: H1.8 2.71,21.12 v1(2.71,20.28) ; FPC6.40 44.19,2.68 38.15,8.72 33.83,8.72 31.37,11.18 25.15,11.18 24.43,11.9 24.43,14.06 24.18,14.31 21.51,14.31 20.37,15.45 v1(19.86,15.45)
  Bottom Layer w0.152: v1(2.71,20.28) 11.1,20.28 15.92,15.45 v1(19.86,15.45)
GPIO10: length 57.9
  Top Layer w0.152: v1(17.32,6.44) 17.32,6.31 17.57,6.06 19.48,6.06 20.03,6.61 20.45,6.61 20.62,6.44 23.16,6.44 v1(24.69,7.96) ; v1(7.41,19.77) 7.41,21.14 H1.7 ; FPC6.39 43.69,2.8 38.15,8.34 33.7,8.34 31.54,10.5 v1(31.16,10.5)
  Bottom Layer w0.152: v1(17.32,6.44) 11.73,6.44 10.33,7.83 10.33,16.85 11.35,17.87 11.35,18.76 10.59,19.52 7.67,19.52 v1(7.41,19.77) ; v1(24.69,7.96) 24.81,7.96 24.99,8.14 25.53,8.14 25.7,7.96 28.62,7.96 v1(31.16,10.5)
GPIO11: length 82.8
  Top Layer w0.152: v1(25.32,7.71) 23.8,6.18 v1(20.24,6.18) ; LED1.4 7.01,48.24 v1(8.05,47.2) ; FPC6.38 43.19,2.79 38.02,7.96 33.45,7.96 31.54,9.87 v1(31.16,9.87)
  Bottom Layer w0.152: v1(25.32,7.71) 29,7.71 v1(31.16,9.87) ; v1(20.24,6.18) 20.24,9.49 21.05,10.29 21.05,37.89 19.86,39.08 10.08,39.08 8.05,41.11 v1(8.05,47.2)
GPIO12: length 75.4
  Top Layer w0.152: v1(22.14,9.36) 24.33,9.36 26.21,7.48 v1(26.21,7.2) ; SW1.3 9.84,46.91 C132.2 9.84,42.52 R81.1 9.83,42.5 v1(9.83,40.98) ; FPC6.37 42.69,2.78 37.77,7.71 32.94,7.71 31.42,9.23 v1(31.16,9.23)
  Bottom Layer w0.152: v1(9.83,40.98) 10.71,40.09 20.34,40.09 21.3,39.13 21.3,10.2 v1(22.14,9.36) ; v1(26.21,7.2) 26.34,7.07 29,7.07 v1(31.16,9.23)
GPIO13: length 73.5
  Top Layer w0.152: v1(31.16,8.6) 31.42,8.6 32.69,7.33 37.77,7.33 42.19,2.9 FPC6.36 ; SW2.3 17.8,46.73 17.8,44.82 ; C133.2 17.85,42.51 R82.1 17.83,42.49 v1(17.83,41.36)
  Bottom Layer w0.152: v1(31.16,8.6) 31.03,8.6 29.13,6.69 24.18,6.69 22.83,8.04 22.83,9.67 21.81,10.69 21.81,32.14 25.7,36.03 25.7,40.63 25.35,40.98 18.21,40.98 v1(17.83,41.36)
GPIO14: length 65.8
  Top Layer w0.152: FPC6.35 41.69,3.02 37.77,6.95 32.69,6.95 31.67,7.96 v1(31.16,7.96) ; v1(25.19,40.09) 25.19,42.16 R83.1 25.54,42.51 C134.2 25.54,47.04 SW3.3
  Bottom Layer w0.152: v1(25.19,40.09) 25.19,35.9 21.56,32.27 21.56,10.58 22.57,9.57 22.57,7.66 23.92,6.31 29.51,6.31 v1(31.16,7.96)
GPIO15: length 26.3
  Top Layer w0.152: R87.1 21.13,8.65 v1(21.13,7.58) ; FPC6.34 41.19,3.01 37.64,6.56 37.62,6.56 32.66,6.56 31.9,7.33 v1(31.16,7.33)
  Bottom Layer w0.152: v1(21.13,7.58) 21.13,6.31 21.38,6.06 29.76,6.06 31.03,7.33 v1(31.16,7.33)
GPIO26_ADC0: length 43.9
  Top Layer w0.152: H1.6 2.09,18.64 v1(1.06,17.61) ; FPC6.15 31.69,2.22 30.91,3.01 v1(22.02,3.01)
  Bottom Layer w0.152: v1(22.02,3.01) 8.56,3.01 1.06,10.5 v1(1.06,17.61)
GPIO27_ADC1: length 38.2
  Top Layer w0.152: v1(9.06,17.36) 7.78,18.64 H1.5 ; v1(25.7,5.04) 25.7,3.9 26.34,3.26 31.29,3.26 32.19,2.36 FPC6.16
  Bottom Layer w0.152: v1(25.7,5.04) 25.24,5.5 11.93,5.5 9.83,7.6 9.83,16.6 v1(9.06,17.36)
HPL: length 38.3
  Top Layer w0.152: C142.2 12.16,18.12 v1(10.84,18.12) ; FPC6.17 32.69,2.24 31.29,3.64 26.97,3.64 26.46,4.15 v1(26.46,5.17)
  Bottom Layer w0.152: v1(26.46,5.17) 25.88,5.76 12.03,5.76 10.08,7.71 10.08,17.36 v1(10.84,18.12)
I2C1_SCL: length 45.1
  Top Layer w0.152: FPC6.25 v1(36.69,2.75) ; v1(38.91,42.12) 39.91,42.12
  Top Layer w0.254: 42.05,43.09 40.88,43.09 R84.2
  Bottom Layer w0.152: v1(36.69,2.75) 36.69,3.59 37.44,4.34 37.44,40.66 v1(38.91,42.12)
I2C1_SDA: length 47.7
  Top Layer w0.152: v1(38.91,44.28) 39.86,44.28 R85.2 ; FPC6.26 v1(37.19,3.39)
  Top Layer w0.254: R85.2 40.64,43.63 FPC5.3
  Bottom Layer w0.152: v1(37.19,3.39) 37.7,3.9 37.7,40.28 38.78,41.36 39.04,41.36 39.67,42 39.67,43.52 v1(38.91,44.28)
LCD_BL: length 26.5
  Top Layer w0.152: Q1.1 24.03,15.95 R1.2 24.18,15.98 v1(24.18,14.82) ; v1(25.19,10.25) 25.19,10.22 26.84,8.57 26.84,7.71 29.64,4.91 31.8,4.91 32.3,4.41 37.26,4.41 38.19,3.47 FPC6.28
  Bottom Layer w0.152: v1(24.18,14.82) 24.56,14.82 25.19,14.18 v1(25.19,10.25)
LCD_D/C: length 44.3
  Top Layer w0.152: FPC6.27 37.69,3.59 37.13,4.15 32.05,4.15 31.67,4.53 29.51,4.53 26.34,7.71 v1(26.34,8.47) ; v1(31.54,29.93) 29.12,29.93 29.03,29.85
  Bottom Layer w0.152: v1(31.54,29.93) 31.42,29.81 27.86,29.81 26.13,28.07 26.13,8.68 v1(26.34,8.47)
LCD_LEDK: length 9.9
  Top Layer w0.254: 29.03,17.35 29.03,18.35 27.99,18.35 27.99,19.65 26.21,21.42 v1(25.45,21.42) ; v1(25.45,19.52) 26.08,18.88 26.08,18.39
  Bottom Layer w0.254: v1(25.45,21.42) v1(25.45,19.52)
LCD_RESET: length 36.6
  Top Layer w0.152: v1(27.86,27.77) 28.96,27.77 29.03,27.85 ; FPC6.29 38.69,3.48 37.26,4.91 32.31,4.91 31.8,5.42 29.64,5.42 27.22,7.83 v1(27.22,8.98)
  Bottom Layer w0.152: v1(27.86,27.77) 27.22,27.14 v1(27.22,8.98)
MIC_IN: length 41.5
  Top Layer w0.152: v1(36.75,39.58) 36.75,39.6 C131.2 ; FPC6.22 v1(35.19,2.75)
  Bottom Layer w0.152: v1(36.75,39.58) 37.19,39.14 37.19,4.75 v1(35.19,2.75)
SPI1_CLK: length 43.8
  Top Layer w0.152: FPC6.31 39.69,3.37 37.38,5.68 32.43,5.68 31.92,6.18 29.89,6.18 28.37,7.71 v1(28.37,9.87) ; v1(32.31,30.44) 29.12,30.44 29.03,30.35
  Bottom Layer w0.152: v1(32.31,30.44) 32.31,28.79 31.67,28.15 29.64,28.15 28.37,26.88 v1(28.37,9.87)
SPI1_CS: length 44.2
  Top Layer w0.152: 29.03,30.85 29.06,30.82 31.8,30.82 v1(32.18,31.2) ; FPC6.33 40.69,3.13 37.51,6.31 32.56,6.31 32.05,6.82 30.78,6.82 29.38,8.22 29.38,9.74 v1(29.76,10.12)
  Bottom Layer w0.152: v1(29.76,10.12) 29.76,26.38 30.27,26.88 31.92,26.88 32.81,27.77 32.81,30.95 32.56,31.2 v1(32.18,31.2)
SPI1_MISO: length 37.8
  Top Layer w0.152: v1(27.86,28.41) 27.92,28.35 29.03,28.35 ; v1(27.86,9.36) 27.86,7.58 29.64,5.8 31.92,5.8 32.43,5.29 37.38,5.29 39.19,3.49 FPC6.30
  Bottom Layer w0.152: v1(27.86,9.36) 27.86,27.14 28.5,27.77 28.5,28.15 28.24,28.41 v1(27.86,28.41)
SPI1_MOSI: length 38.2
  Top Layer w0.152: 29.03,28.85 30.34,28.85 30.53,28.66 v1(30.53,27.65) ; v1(28.88,10.25) 28.88,7.96 30.4,6.44 32.03,6.44 32.16,6.31 32.18,6.31 32.56,5.93 37.53,5.93 40.19,3.27 FPC6.32
  Bottom Layer w0.152: v1(30.53,27.65) 30.15,27.65 29,26.5 29,10.37 v1(28.88,10.25)
TOUCH_INT: length 60.7
  Top Layer w0.152: v1(43.23,48.09) 43.23,44.41 42.94,44.13 FPC5.4 ; v1(32.94,2.75) 33.19,2.5 FPC6.18
  Bottom Layer w0.152: v1(32.94,2.75) 32.94,10 36.07,13.12 36.07,48.45 36.22,48.6 42.72,48.6 v1(43.23,48.09)
TOUCH_RST: length 56.2
  Top Layer w0.152: FPC5.5 42.02,44.66 41.19,44.66 40.94,44.92 v1(40.94,47.33) ; FPC6.19 v1(33.69,2.75)
  Bottom Layer w0.152: v1(40.94,47.33) 40.05,48.22 36.6,48.22 36.32,47.94 36.32,12.61 33.69,9.98 v1(33.69,2.75)
USART1_RX: length 41.9
  Top Layer w0.152: H1.2 2.65,11.46 v1(2.59,11.39) ; FPC6.23 35.69,2.92 35.23,3.39 31.9,3.39 31.39,3.9 27.73,3.9 27.48,4.15 v1(27.35,4.15)
  Bottom Layer w0.152: v1(27.35,4.15) 25.57,4.15 24.94,3.52 8.41,3.52 2.59,9.34 v1(2.59,11.39)
USART1_TX: length 40.7
  Top Layer w0.152: v1(7.41,11.39) 7.41,13.52 H1.1 ; v1(27.35,4.91) 28.11,4.15 31.5,4.15 32.01,3.64 35.33,3.64 35.35,3.64 36.19,2.81 FPC6.24
  Bottom Layer w0.152: v1(7.41,11.39) 7.54,11.39 7.41,11.26 7.41,4.91 8.5,3.82 24.89,3.82 25.47,4.41 26.84,4.41 v1(27.35,4.91)
USB4_D+: length 33.4
  Top Layer w0.152: U3.3 17.32,3.41 17.32,4.02 17.06,4.28 v1(15.8,4.28) ; H1.3 7.29,15.93 v1(7.29,14.57) ; v1(19.22,4.28) 20.92,2.58 26.76,2.58 27.19,2.15 FPC6.6
  Bottom Layer w0.152: v1(7.29,14.57) 7.54,14.31 8.94,14.31 9.44,13.8 9.44,7.37 11.69,5.12 14.95,5.12 v1(15.8,4.28) v1(19.22,4.28)
USB4_D-: length 38
  Top Layer w0.152: U3.2 16.56,3.34 16.56,2.63 16.94,2.25 ; H1.4 2.71,16.04 v1(2.71,14.95) ; v1(17.32,2.25) 16.94,2.25 ; 16.94,2.25 15.8,2.25 15.41,2.63 13.64,2.63 13.38,2.37 11.35,2.37 10.08,3.64 v1(10.08,4.28) ; FPC6.5 26.69,0.82 26.34,0.47 21.38,0.47 20.75,1.1 v1(20.75,1.87)
  Bottom Layer w0.152: v1(2.71,14.95) 3.6,14.95 5,13.55 5,13.17 6.27,11.9 8.43,11.9 9.06,11.26 9.06,5.29 v1(10.08,4.28) ; v1(17.32,2.25) 17.7,1.87 v1(20.75,1.87)
$1N5124: length 6.9
  Top Layer w0.152: Q2.1 19.11,10.96 v2(19.11,12.03) ; R87.2 v2(19.11,7.45)
  Bottom Layer w0.152: v2(19.11,7.45) v2(19.11,12.03)
$1N5125: length 8.4
  Top Layer w0.152: U20.1 20.07,13.35 Q2.3 21.97,11.52 v1(22.27,11.52) ; v1(23.41,12.41) R86.1
  Bottom Layer w0.152: v1(23.41,12.41) 23.16,12.41 v1(22.27,11.52)
$1N5129: length 4.2
  Top Layer w0.152: C140.2 16.53,14.07 U20.2 U20.3
$1N5132: length 5.5
  Top Layer w0.152: R88.2 12.4,14.22 U20.4 11.6,11.68 R89.1
$1N7696: length 6.6
  Top Layer w0.254: R90.1 34.96,43.25 C131.1 35.03,45.32 34.37,45.98 34.37,46.91
$1N12468: length 5.3
  Top Layer w0.152: R2.1 23.65,18.88 21.86,18.88 Q1.3
$1N17864: length 2.3
  Top Layer w0.152: C142.1 14.4,17.88 R88.1
$1N17956: length 13.4
  Top Layer w0.152: U20.8 17.11,7.96 v1(17.83,7.96) ; v1(12.11,7.07) 12.11,7.07 H3.2
  Bottom Layer w0.152: v1(17.83,7.96) 13,7.96 v1(12.11,7.07)
$1N17960: length 7.2
  Top Layer w0.254: U20.5 13.05,7.99 11.48,9.55 ; H3.1 10,8.06 11.48,9.55 ; 11.48,9.55 R89.2

## Copper pours and planes (outline as drawn; the poured copper is in the pictures)
GND on Top Layer: -0.21,50.25 70.28,50.25 70.28,-0.29 -0.21,-0.29
GND on Bottom Layer: -0.33,50.38 70.41,50.38 70.41,-0.42 -0.33,-0.42

## Text on the board
Bottom Silkscreen Layer: 2.8'' ISP TFT Screen | Do not place any components!
Top Silkscreen Layer: FPC 0.5mm 50P 5cm Wire | MINI PC Board / V1.1 / xddcore
